# Altium schematic sheet PotsDuino.SchDoc
size A4; DocumentNumber: 1; SheetNumber: 1; SheetTotal: 2
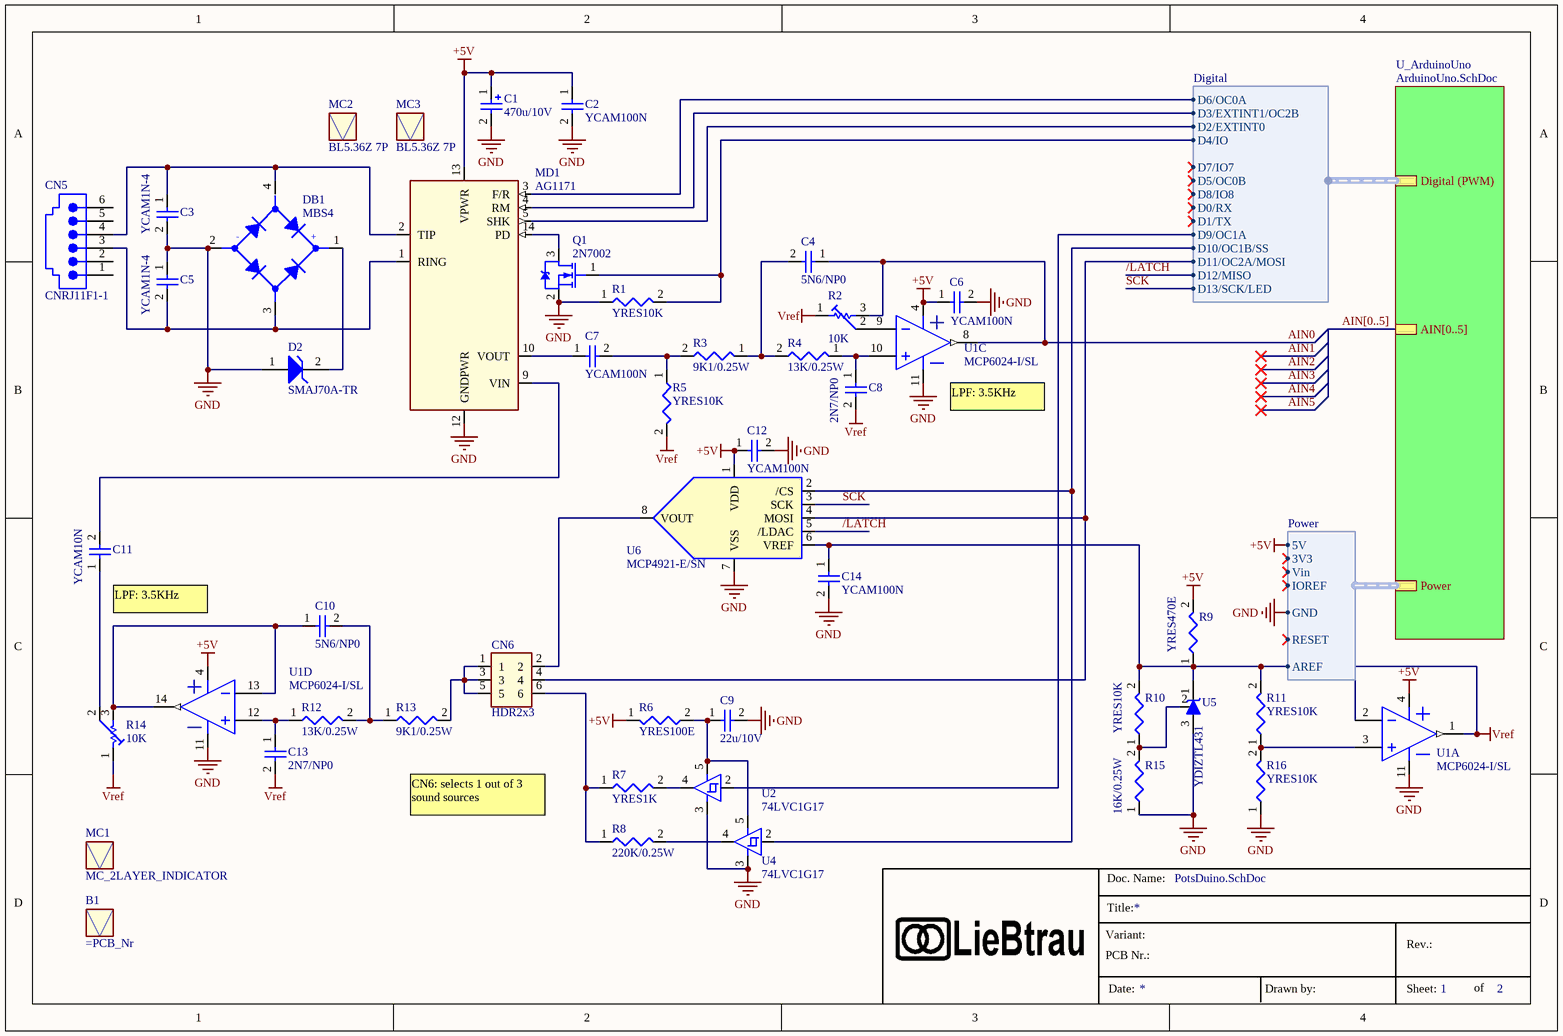
[diagram p0: PotsDuino.SchDoc]

## Parts
B1  (no value)  (mechanical)
C1  470u/10V  [CA_CANSMD103_H100]
C2  YCAM100N  [CA_1206]
C3  YCAM1N-4  [CA_1206_H16]
C4  5N6/NP0  [CA_0603]
C5  YCAM1N-4  [CA_1206_H16]
C6  YCAM100N  [CA_1206]
C7  YCAM100N  [CA_1206]
C8  2N7/NP0  [CA_1206]
C9  22u/10V  [CA_1206]
C10  5N6/NP0  [CA_0603]
C11  YCAM10N  [CA_1206]
C12  YCAM100N  [CA_1206]
C13  2N7/NP0  [CA_1206]
C14  YCAM100N  [CA_1206]
CN5  CNRJ11F1-1  [CN_MODJACK_6P]
CN6  HDR2x3  [CN_HDR2X3]
D2  SMAJ70A-TR  [DI_DO-214AC]
DB1  MBS4  [SC_SO4]
MC1  MC_2LAYER_INDICATOR  [MC_2LAYER_INDICATOR]  (no BOM)
MC2  BL5.36Z 7P  [CN_TOP_ENTRY_SOCKET_7P_NOHOLES]
MC3  BL5.36Z 7P  [CN_TOP_ENTRY_SOCKET_7P_NOHOLES]
MD1  AG1171  [MD_AG1171]
Q1  2N7002  [SC_SOT23]
R1  YRES10K  [RE_1206]
R2  10K  [RE_TRIM_BOURNS_67W]
R3  9K1/0.25W  [RE_1206]
R4  13K/0.25W  [RE_1206]
R5  YRES10K  [RE_1206]
R6  YRES100E  [RE_1206]
R7  YRES1K  [RE_1206]
R8  220K/0.25W  [RE_1206]
R9  YRES470E  [RE_1206]
R10  YRES10K  [RE_1206]
R11  YRES10K  [RE_1206]
R12  13K/0.25W  [RE_1206]
R13  9K1/0.25W  [RE_1206]
R14  10K  [RE_TRIM_BOURNS_67W]
R15  16K/0.25W  [RE_1206]
R16  YRES10K  [RE_1206]
U1  MCP6024-I/SL  [SC_SOIC14]  (parts A,C,D of 4)
U2  74LVC1G17  [SC_SOT23-5AM]
U4  74LVC1G17  [SC_SOT23-5AM]
U5  YDIZTL431  [SC_SOT23]
U6  MCP4921-E/SN  [SC_SOIC8]

## Sub-sheets
U_ArduinoUno = ArduinoUno.SchDoc: Digital (PWM) (harness Digital), Power (harness Power), AIN[0..5]

## Harnesses
Power: RESET, 3V3, 5V, GND, Vin, AREF, IOREF
Digital: D0/RX, D1/TX, D2/EXTINT0, D3/EXTINT1/OC2B, D4/IO, D5/OC0B, D6/OC0A, D7/IO7, D9/OC1A, D10/OC1B/SS, D11/OC2A/MOSI, D12/MISO, D13/SCK/LED, D8/IO8

## Nets
+5V: C1.1 C2.1 C6.1 C12.1 MD1.13(VPWR) R6.1 R9.2 U1.4(VDD) U6.1(VDD) ; sheet U_ArduinoUno/Power.5V
GND: C1.2 C2.2 C3.2 C5.1 C6.2 C9.2 C12.2 C14.2 D2.1(A) DB1.2(-DC) MD1.12(GNDPWR) Q1.2(S) R1.1 R15.1 R16.1 U1.11(VSS) U2.3(A) U4.3(A) U5.3(A) U6.7(VSS) ; sheet U_ArduinoUno/Power.GND
Vref: C8.2 C13.2 R2.1(CCW) R5.2 R14.1(CCW) U1.1(VOUTA) U1.2(VINA-)
/LATCH: U6.5(/LDAC) ; sheet U_ArduinoUno/Digital (PWM).D12/MISO
AIN0: C4.1 R2.3(CW) U1.8(VOUTC)
SCK: U6.3(SCK) ; sheet U_ArduinoUno/Digital (PWM).D13/SCK/LED
NetC3_1: C3.1 CN5.4 DB1.4(AC1) MD1.2(TIP)
NetC4_2: C4.2 R3.1 R4.2
NetC5_2: C5.2 CN5.3 DB1.3(AC2) MD1.1(RING)
NetC7_1: C7.1 MD1.10(VOUT)
NetC7_2: C7.2 R3.2 R5.1
NetC8_1: C8.1 R4.1 U1.10(VINC+)
NetC9_1: C9.1 R6.2 U2.5(A) U4.5(A)
NetC10_1: C10.1 R14.3(CW) U1.13(VIND-) U1.14(VOUTD)
NetC10_2: C10.2 R12.2 R13.1
NetC11_1: C11.1 R14.2(TAP)
NetC11_2: C11.2 MD1.9(VIN)
NetC13_1: C13.1 R12.1 U1.12(VIND+)
NetC14_1: C14.1 R9.1 R10.2 R11.2 U5.1(C) U6.6(VREF) ; sheet U_ArduinoUno/Power.AREF
NetCN6_1: CN6.1 CN6.3 CN6.5 R13.2
NetCN6_2: CN6.2 U6.8(VOUT)
NetCN6_4: CN6.4 U6.4(MOSI) ; sheet U_ArduinoUno/Digital (PWM).D11/OC2A/MOSI
NetCN6_6: CN6.6 R7.1 R8.1
NetD2_2: D2.2(K) DB1.1(+DC)
NetMD1_3: MD1.3(F/R) ; sheet U_ArduinoUno/Digital (PWM).D6/OC0A
NetMD1_4: MD1.4(RM) ; sheet U_ArduinoUno/Digital (PWM).D3/EXTINT1/OC2B
NetMD1_5: MD1.5(SHK) ; sheet U_ArduinoUno/Digital (PWM).D2/EXTINT0
NetMD1_14: MD1.14(PD) Q1.3(D)
NetQ1_1: Q1.1(G) R1.2 ; sheet U_ArduinoUno/Digital (PWM).D4/IO
NetR2_2: R2.2(TAP) U1.9(VINC-)
NetR7_2: R7.2 U2.4(A)
NetR8_2: R8.2 U4.4(A)
NetR10_1: R10.1 R15.2 U5.2(Ref)
NetR11_1: R11.1 R16.2 U1.3(VINA+)
NetU2_2: U2.2(A) ; sheet U_ArduinoUno/Digital (PWM).D9/OC1A
NetU4_2: U4.2(A) U6.2(/CS) ; sheet U_ArduinoUno/Digital (PWM).D10/OC1B/SS

Not connected (* = marked no-connect by the designer): CN5 1 2 5 6

## Buses and harness runs
bus AIN[0..5] = sheet U_ArduinoUno/AIN[0..5]

## Notes on the sheet
- (near U1) LPF: 3.5KHz
- (near C11) LPF: 3.5KHz
- CN6: selects 1 out of 3 sound sources
- Title:
- Doc. Name:
- Variant:
- PCB Nr.:
- Date:
- Drawn by:
- Rev.:
- Sheet:
- of
- (in symbol MBS4) -; +

## Library data of the parts
B1 = BARE_PCB: Part Number: BARE_PCB
C1 = EEEFC1A471P: Manufacturer: Panasonic; Order Code: Farnell 9693483; Part Number: EEEFC1A471P; Component Type: capacitor
C2 C6 C7 C12 C14 = YCAM100N: Order Code: Farnell 1759361; Part Number: YCAM100N; Component Type: capacitor
C3 C5 = YCAM1N-4: Manufacturer: AVX; Order Code: Farnell 1216467; Part Number: YCAM1N-4; Component Type: capacitor
C4 C10 = C0603C562J5GACTU: Manufacturer: KEMET; Order Code: Farnell 1813425; Part Number: C0603C562J5GACTU; Component Type: capacitor
C8 C13 = CC1206JRNPO9BN272: Manufacturer: YAGEO (PHYCOMP); Order Code: Farnell 718610; Part Number: CC1206JRNPO9BN272; Component Type: capacitor
C9 = 1206ZC226KAT2A: Manufacturer: AVX; Order Code: Farnell 2094045; Part Number: 1206ZC226KAT2A; Component Type: capacitor
C11 = YCAM10N: Manufacturer: Multicomp; Order Code: Farnell 1759350; Part Number: YCAM10N; Component Type: capacitor
CN5 = CNRJ11F1-1: Order Code: Farnell 1536490; Part Number: CNRJ11F1-1; Component Type: connector
CN6 = 826656-3: Manufacturer: Tyco Electronics; Order Code: RS: 6689609P; Part Number: 826656-3; Component Type: connector
D2 = SMAJ70A-TR: Manufacturer: STMICROELECTRONICS; Order Code: Farnell 1749313; Part Number: SMAJ70A-TR; Component Type: zener
DB1 = MBS4: Manufacturer: TAIWAN SEMICONDUCTOR; Order Code: Farnell 4084985; Part Number: MBS4; Component Type: bridge rectifier
MC2 MC3 = BL5.36Z 7P MECH: Manufacturer: Fischer Elektronik; Order Code: Farnell 9728910; Part Number: BL5.36Z 7P MECH; Component Type: connector
MD1 = AG1171: Manufacturer: Silvertel; Part Number: AG1171; Component Type: SLIC
Q1 = 2N7002: Order Code: Farnell 9845313RL; Part Number: 2N7002; Component Type: transistor
R1 R5 R10 R11 R16 = YRES10K: Resistor; Manufacturer: Vishay Draloric; Order Code: Farnell 1469970; Part Number: YRES10K; Component Type: resistor
R2 R14 = 67WR10KLF: Manufacturer: BI TECHNOLOGIES/TT ELECTRONICS; Order Code: Farnell 1703794; Part Number: 67WR10KLF; Component Type: resistor
R3 R13 = CRCW12069K10FKEA: Resistor; Manufacturer: VISHAY DRALORIC; Order Code: Farnell 2139507; Part Number: CRCW12069K10FKEA; Component Type: resistor
R4 R12 = MCMR12X1302FTL: Resistor; Manufacturer: Multicomp; Order Code: Farnell 2073889; Part Number: MCMR12X1302FTL; Component Type: resistor
R6 = YRES100E: Resistor; Manufacturer: Multicomp; Order Code: Farnell 2073876; Part Number: YRES100E; Component Type: resistor
R7 = YRES1K: Resistor; Manufacturer: Vishay Draloric; Order Code: Farnell 1469965; Part Number: YRES1K; Component Type: resistor
R8 = RC1206FR-07220KL: Resistor; Manufacturer: Yageo (Phycomp); Order Code: Farnell 9241086; Part Number: RC1206FR-07220KL; Component Type: resistor
R9 = YRES470E: Resistor; Manufacturer: Multicomp; Order Code: Farnell 2074657; Part Number: YRES470E; Component Type: resistor
R15 = CRCW120616K0FKEA: Resistor; Manufacturer: Vishay Draloric; Order Code: Farnell 2139521; Part Number: CRCW120616K0FKEA; Component Type: resistor
U1 = MCP6024-I/SL: Manufacturer: Microchip; Order Code: Farnell 1292247; Part Number: MCP6024-I/SL; Component Type: opamp
U2 U4 = 74LVC1G17W5-7: Manufacturer: Diodes Inc.; Order Code: Farnell 1893835; Part Number: 74LVC1G17W5-7; Component Type: logic
U5 = YDIZTL431: Manufacturer: Diodes.Inc; Order Code: Farnell 1904055; Part Number: YDIZTL431; Component Type: zener
U6 = MCP4921-E/SN: Manufacturer: Microchip; Order Code: Farnell 1332113; Part Number: MCP4921-E/SN; Component Type: dac
MC1 = MC_2LAYER_INDICATOR: Part Number: MC_2LAYER_INDICATOR